# Altium schematic sheet light.SchDoc
size A3
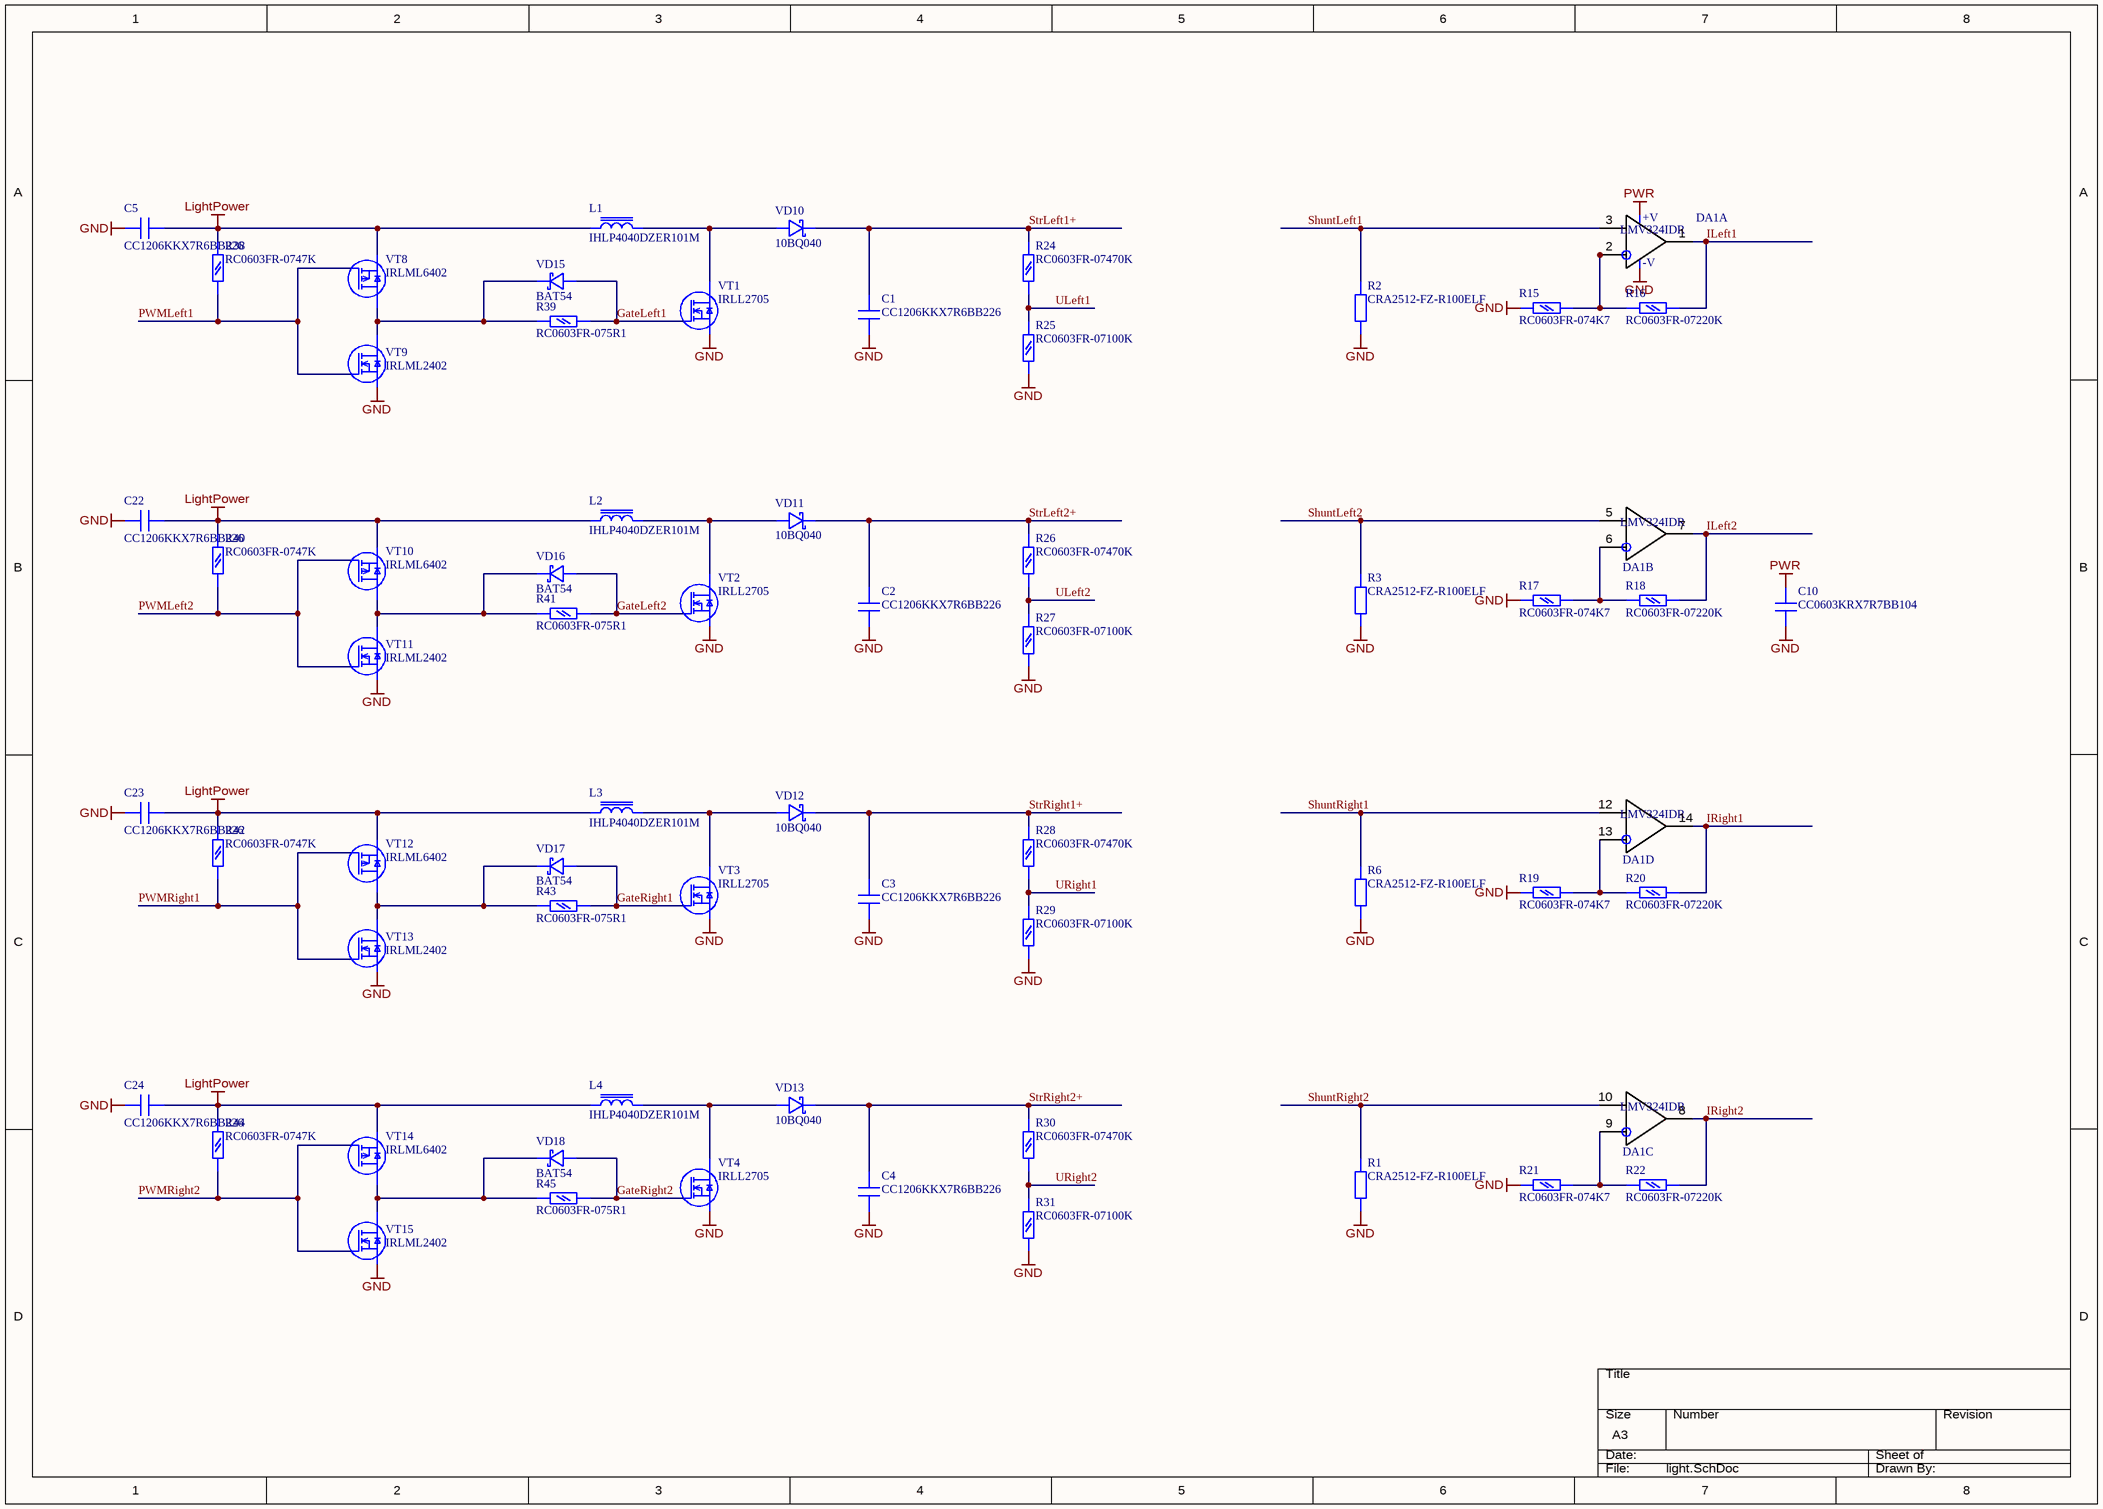
[diagram p0: light.SchDoc]

## Parts
C1  CC1206KKX7R6BB226  [CapacitorSMD1206(reflow)]
C2  CC1206KKX7R6BB226  [CapacitorSMD1206(reflow)]
C3  CC1206KKX7R6BB226  [CapacitorSMD1206(reflow)]
C4  CC1206KKX7R6BB226  [CapacitorSMD1206(reflow)]
C5  CC1206KKX7R6BB226  [CapacitorSMD1206(reflow)]
C10  CC0603KRX7R7BB104  [CapacitorSMD0603(manual)]
C22  CC1206KKX7R6BB226  [CapacitorSMD1206(reflow)]
C23  CC1206KKX7R6BB226  [CapacitorSMD1206(reflow)]
C24  CC1206KKX7R6BB226  [CapacitorSMD1206(reflow)]
DA1  LMV324IDR  [SO14]  (parts A,B,C,D of 4)
L1  IHLP4040DZER101M  [IHLP-4040DZ(manual/deep1.5mm)]
L2  IHLP4040DZER101M  [IHLP-4040DZ(manual/deep1.5mm)]
L3  IHLP4040DZER101M  [IHLP-4040DZ(manual/deep1.5mm)]
L4  IHLP4040DZER101M  [IHLP-4040DZ(manual/deep1.5mm)]
R1  CRA2512-FZ-R100ELF  [ResistorSMD2512(reflow)]
R2  CRA2512-FZ-R100ELF  [ResistorSMD2512(reflow)]
R3  CRA2512-FZ-R100ELF  [ResistorSMD2512(reflow)]
R6  CRA2512-FZ-R100ELF  [ResistorSMD2512(reflow)]
R15  RC0603FR-074K7  [ResistorSMD0603(manual)]
R16  RC0603FR-07220K  [ResistorSMD0603(manual)]
R17  RC0603FR-074K7  [ResistorSMD0603(manual)]
R18  RC0603FR-07220K  [ResistorSMD0603(manual)]
R19  RC0603FR-074K7  [ResistorSMD0603(manual)]
R20  RC0603FR-07220K  [ResistorSMD0603(manual)]
R21  RC0603FR-074K7  [ResistorSMD0603(manual)]
R22  RC0603FR-07220K  [ResistorSMD0603(manual)]
R24  RC0603FR-07470K  [ResistorSMD0603(manual)]
R25  RC0603FR-07100K  [ResistorSMD0603(manual)]
R26  RC0603FR-07470K  [ResistorSMD0603(manual)]
R27  RC0603FR-07100K  [ResistorSMD0603(manual)]
R28  RC0603FR-07470K  [ResistorSMD0603(manual)]
R29  RC0603FR-07100K  [ResistorSMD0603(manual)]
R30  RC0603FR-07470K  [ResistorSMD0603(manual)]
R31  RC0603FR-07100K  [ResistorSMD0603(manual)]
R38  RC0603FR-0747K  [ResistorSMD0603(manual)]
R39  RC0603FR-075R1  [ResistorSMD0603(manual)]
R40  RC0603FR-0747K  [ResistorSMD0603(manual)]
R41  RC0603FR-075R1  [ResistorSMD0603(manual)]
R42  RC0603FR-0747K  [ResistorSMD0603(manual)]
R43  RC0603FR-075R1  [ResistorSMD0603(manual)]
R44  RC0603FR-0747K  [ResistorSMD0603(manual)]
R45  RC0603FR-075R1  [ResistorSMD0603(manual)]
VD10  10BQ040  [SMB_10BQ40]
VD11  10BQ040  [SMB_10BQ40]
VD12  10BQ040  [SMB_10BQ40]
VD13  10BQ040  [SMB_10BQ40]
VD15  BAT54  [SOT23]
VD16  BAT54  [SOT23]
VD17  BAT54  [SOT23]
VD18  BAT54  [SOT23]
VT1  IRLL2705  [SOT223]
VT2  IRLL2705  [SOT223]
VT3  IRLL2705  [SOT223]
VT4  IRLL2705  [SOT223]
VT8  IRLML6402  [SOT23]
VT9  IRLML2402  [SOT23]
VT10  IRLML6402  [SOT23]
VT11  IRLML2402  [SOT23]
VT12  IRLML6402  [SOT23]
VT13  IRLML2402  [SOT23]
VT14  IRLML6402  [SOT23]
VT15  IRLML2402  [SOT23]

## Nets
GND: C1.1 C2.1 C3.1 C4.1 C5.2 C10.1 C22.2 C23.2 C24.2 DA1.11 R1.1 R2.1 R3.1 R6.1 R15.1 R17.1 R19.1 R21.1 R25.1 R27.1 R29.1 R31.1 VT1.3(S) VT2.3(S) VT3.3(S) VT4.3(S) VT9.2(S) VT11.2(S) VT13.2(S) VT15.2(S)
LightPower: C5.1 C22.1 C23.1 C24.1 L1.1 L2.1 L3.1 L4.1 R38.1 R40.1 R42.1 R44.1 VT8.2(S) VT10.2(S) VT12.2(S) VT14.2(S)
PWR: C10.2 DA1.4
GateLeft1: R39.1 VD15.1 VT1.1(G)
GateLeft2: R41.1 VD16.1 VT2.1(G)
GateRight1: R43.1 VD17.1 VT3.1(G)
GateRight2: R45.1 VD18.1 VT4.1(G)
ILeft1: DA1.1 R16.2
ILeft2: DA1.7 R18.2
IRight1: DA1.14 R20.2
IRight2: DA1.8 R22.2
PWMLeft1: R38.2 VT8.1(G) VT9.1(G)
PWMLeft2: R40.2 VT10.1(G) VT11.1(G)
PWMRight1: R42.2 VT12.1(G) VT13.1(G)
PWMRight2: R44.2 VT14.1(G) VT15.1(G)
ShuntLeft1: DA1.3 R2.2
ShuntLeft2: DA1.5 R3.2
ShuntRight1: DA1.12 R6.2
ShuntRight2: DA1.10 R1.2
StrLeft1+: C1.2 R24.2 VD10.2
StrLeft2+: C2.2 R26.2 VD11.2
StrRight1+: C3.2 R28.2 VD12.2
StrRight2+: C4.2 R30.2 VD13.2
ULeft1: R24.1 R25.2
ULeft2: R26.1 R27.2
URight1: R28.1 R29.2
URight2: R30.1 R31.2
NetDA1_2: DA1.2 R15.2 R16.1
NetDA1_6: DA1.6 R17.2 R18.1
NetDA1_9: DA1.9 R21.2 R22.1
NetDA1_13: DA1.13 R19.2 R20.1
NetL1_2: L1.2 VD10.1 VT1.2(D)
NetL2_2: L2.2 VD11.1 VT2.2(D)
NetL3_2: L3.2 VD12.1 VT3.2(D)
NetL4_2: L4.2 VD13.1 VT4.2(D)
NetR39_2: R39.2 VD15.3 VT8.3(D) VT9.3(D)
NetR41_2: R41.2 VD16.3 VT10.3(D) VT11.3(D)
NetR43_2: R43.2 VD17.3 VT12.3(D) VT13.3(D)
NetR45_2: R45.2 VD18.3 VT14.3(D) VT15.3(D)

## Notes on the sheet
- (in symbol OpAmp_Quad_SO14, part A) +V; -V

## Library data of the parts
C1-C5 C22-C24 = CapacitorSMD1206(reflow): CAPACITOR Capacitor SMD 1206 3.2x1.6mm; Описание: Конденсатор SMD 1206; NumberSolderPointsSMD: 0; Аналог: нет; NumberSolderPointsTHT: 0
C10 = CapacitorSMD0603(reflow): CAPACITOR Capacitor SMD 0603 1.6x0.8mm; Описание: Конденсатор SMD 0603; NumberSolderPointsSMD: 0; Аналог: нет; NumberSolderPointsTHT: 0
DA1 = OpAmp_Quad_SO14: IC generic quad op amp SO14; Описание: Микросхема SO14; NumberSolderPointsSMD: 0; Аналог: нет; NumberSolderPointsTHT: 0; x: LMV324ID
L1-L4 = IHLP-4040DZ: MAGNETIC Inductor SMD 4040 h=4mm; Описание: Индуктивность SMD 2525; NumberSolderPointsSMD: 0; Аналог: нет; NumberSolderPointsTHT: 0
R1-R3 R6 = ResistorSMD2512(reflow): RESISTOR Resistor SMD 2512 6.35x3.2mm; Описание: Резистор SMD 2512; NumberSolderPointsSMD: 0; Аналог: нет; NumberSolderPointsTHT: 0
R15-R22 R24-R31 R38-R45 = ResistorSMD0603(reflow): RESISTOR Resistor SMD 0603 1.6x0.8mm; Описание: Резистор SMD 0603; NumberSolderPointsSMD: 0; Аналог: нет; NumberSolderPointsTHT: 0
VD10-VD13 = 10BQ___: DIODE Schottky rectifier; Описание: Диод SMB; NumberSolderPointsSMD: 0; Аналог: нет; x: 10bq015/030/040/060/100; NumberSolderPointsTHT: 0
VD15-VD18 = BAT54: DIODE Schottky barrier diodes; Описание: Диод SOT23; NumberSolderPointsSMD: 0; Аналог: нет; NumberSolderPointsTHT: 0; x: *
VT1-VT4 = MOSFET_N_SOT223: TRANSISTOR MOSFET N generic sot23; Описание: Транзистор SOT223; NumberSolderPointsSMD: 0; Аналог: нет; x: IRLL2705(55v,3.8A,0.04ohm); NumberSolderPointsTHT: 0
VT8 VT10 VT12 VT14 = MOSFET_P_sot23: TRANSISTOR MOSFET P generic sot23; Описание: Транзистор SOT23; NumberSolderPointsSMD: 0; Аналог: нет; NumberSolderPointsTHT: 0; x: IRLML6402
VT9 VT11 VT13 VT15 = MOSFET_N_sot23: TRANSISTOR MOSFET N generic sot23; Описание: Транзистор SOT23; NumberSolderPointsSMD: 0; Аналог: нет; NumberSolderPointsTHT: 0; x: IRLML2402